# EAGLE design rs232 (EAGLE 5.11)
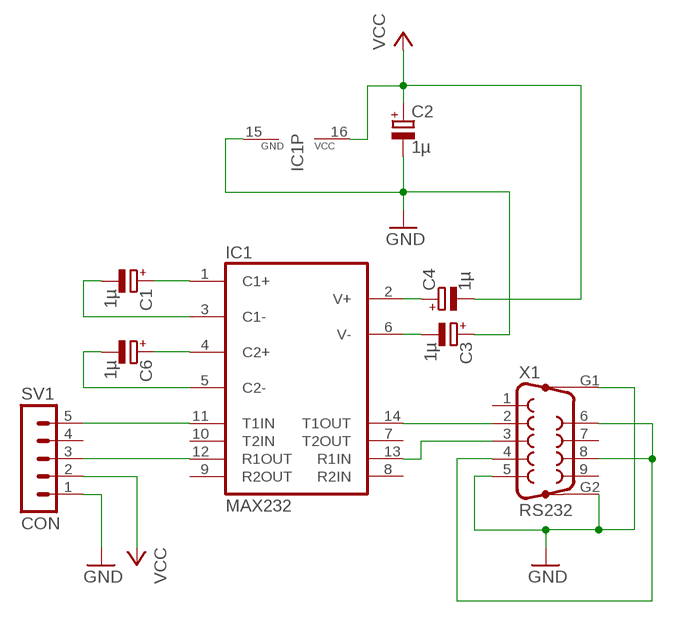
[diagram p0: schematic, sheet 1]

## Parts
C1  1µ  CPOL-EUE2.5-6  [E2,5-6]
C2  1µ  CPOL-EUE2.5-6  [E2,5-6]
C3  1µ  CPOL-EUE2.5-6  [E2,5-6]
C4  1µ  CPOL-EUE2.5-6  [E2,5-6]
C6  1µ  CPOL-EUE2.5-6  [E2,5-6]
IC1  MAX232  [DIL16]
SV1  CON  MA05-1  [MA05-1]
X1  RS232  F09HP  [F09HP]

## Nets
GND: C2.- C3.+ IC1.15(GND) SV1.1 X1.5 X1.G1 X1.G2
N$1: C1.+ IC1.1(C1+)
N$2: C1.- IC1.3(C1-)
N$3: C6.+ IC1.4(C2+)
N$4: C6.- IC1.5(C2-)
N$5: IC1.11(T1IN) SV1.5
N$6: IC1.12(R1OUT) SV1.3
N$7: C3.- IC1.6(V-)
N$8: C4.+ IC1.2(V+)
N$16: IC1.14(T1OUT) X1.2
N$17: IC1.13(R1IN) X1.3
N$18: X1.4 X1.6 X1.8
VCC: C2.+ C4.- IC1.16(VCC) SV1.2
Unconnected: IC1.7(T2OUT) IC1.8(R2IN) IC1.9(R2OUT) IC1.10(T2IN) SV1.4 X1.1 X1.7 X1.9

## Library data of the parts
C1-C4 C6 = rcl:CPOL-EU: POLARIZED CAPACITOR, European symbol
IC1 = maxim:MAX232: RS232 TRANSEIVER; MF: MAXIM; MPN: MAX232ACPE+; OC_FARNELL: 9723773; OC_NEWARK: 68K4544
SV1 = con-lstb:MA05-1: PIN HEADER; OC_FARNELL: unknown; OC_NEWARK: unknown
X1 = con-subd:F09HP: SUB-D; OC_FARNELL: unknown; OC_NEWARK: unknown

## Board
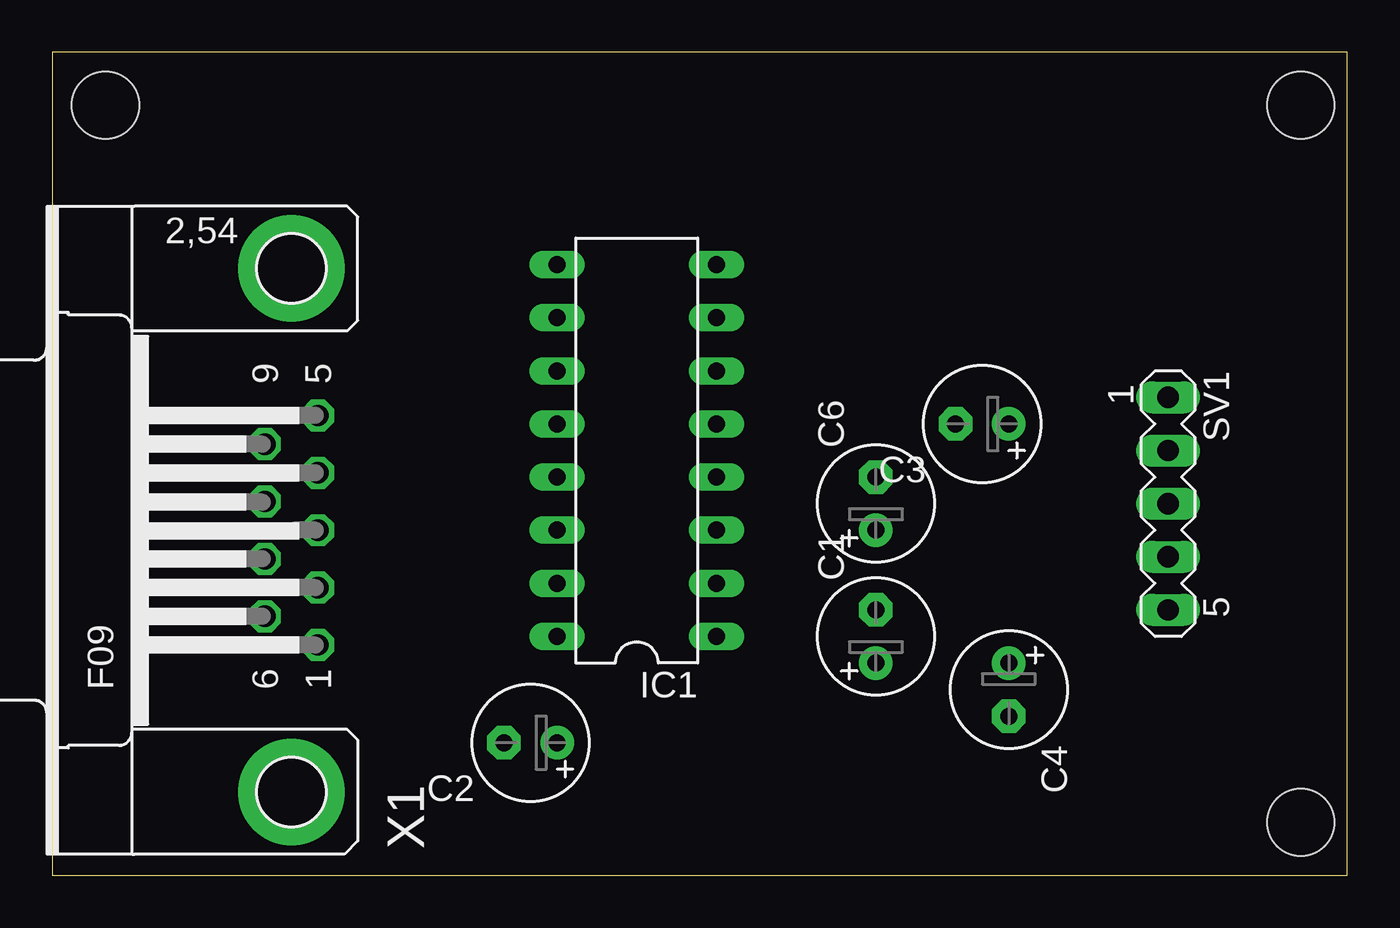
[diagram p1: board, top side]
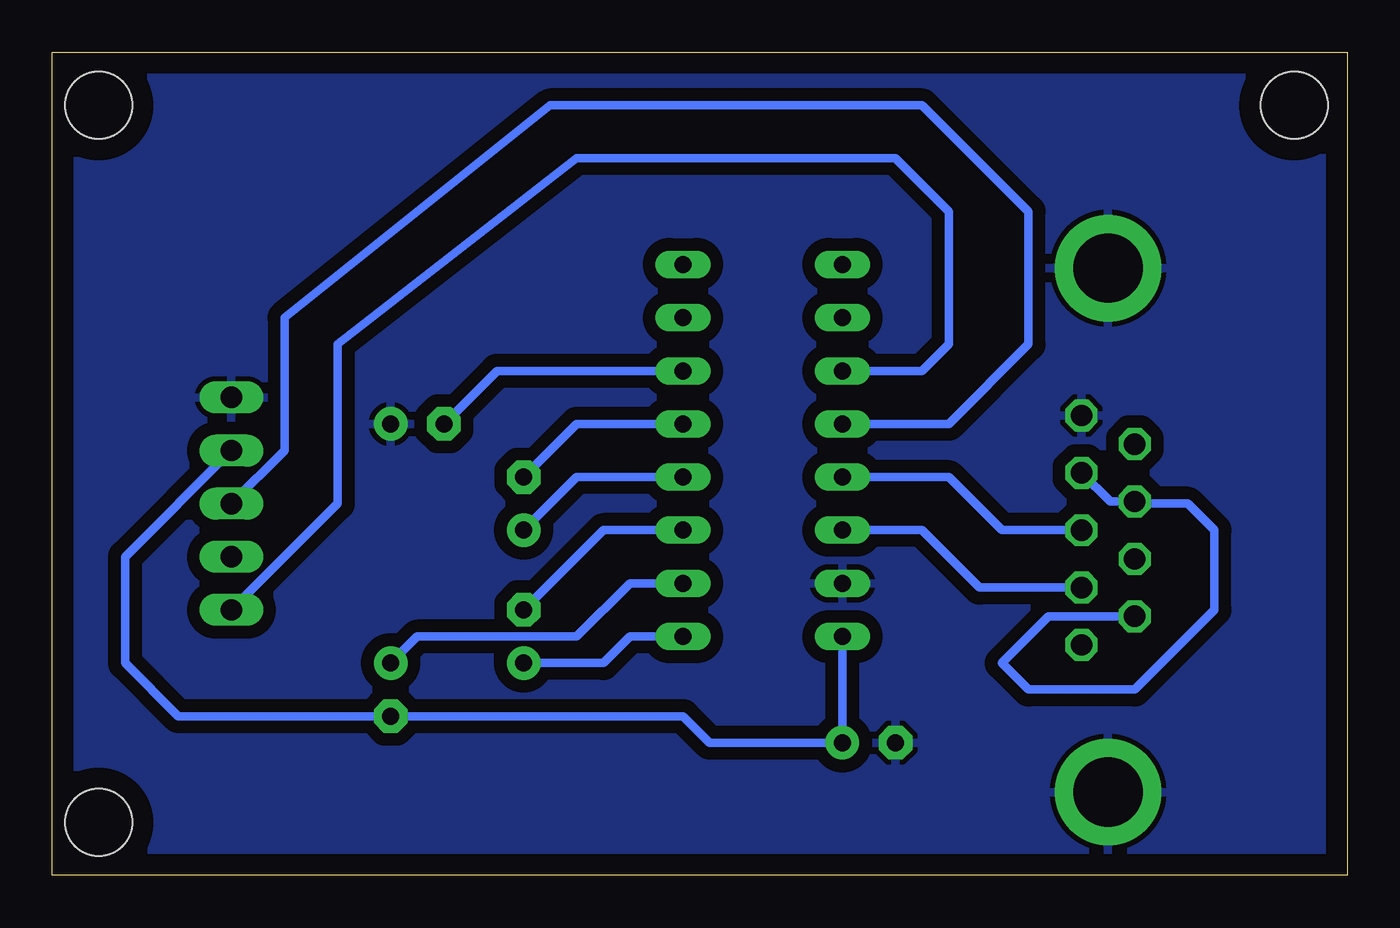
[diagram p2: board, bottom side, seen from below]

Size 61.9 x 39.36 mm. Coordinates in mm from the lower left corner, seen from the top.
Outline: 0,0 61.9,0 61.9,39.36 0,39.36 0,0
Copper layers (1*16): Top 0.035mm / dielectric 1.5mm / Bottom 0.035mm
Design rules "default": minimum track width 10mil, minimum drill 24mil, track to track 8mil, track to pad 8mil, pad to pad 8mil, via to via 8mil, smd to smd 8mil, copper to edge 40mil, drill to drill 8mil, minimum pad ring 10mil, minimum via ring 8mil, stop-mask expansion 4mil, vias tented up to drill 0mil, thermal gap 10mil
Holes 3.2 mm at 2.54,36.83 59.69,36.83 59.69,2.54

### Footprints (pad centres in the part's own frame; a part is rotated, then mirrored left to right if it is on the bottom)
E2,5-6 = drill 0.813 pad 1.6 round: + -1.27,0 | drill 0.813 pad 1.6 octagon: - 1.27,0
DIL16 = drill 0.813 long: 1 -8.89,-3.81; 2 -6.35,-3.81; 3 -3.81,-3.81; 4 -1.27,-3.81; 5 1.27,-3.81; 6 3.81,-3.81; 7 6.35,-3.81; 8 8.89,-3.81; 9 8.89,3.81; 10 6.35,3.81; 11 3.81,3.81; 12 1.27,3.81; 13 -1.27,3.81; 14 -3.81,3.81; 15 -6.35,3.81; 16 -8.89,3.81
MA05-1 = drill 1.016 long: 1 -5.08,0; 2 -2.54,0; 3 0,0; 4 2.54,0; 5 5.08,0
F09HP = drill 1.016 octagon: 1 -5.486,-1.27; 2 -2.743,-1.27; 3 0,-1.27; 4 2.743,-1.27; 5 5.486,-1.27; 6 -4.115,1.27; 7 -1.372,1.27; 8 1.372,1.27; 9 4.115,1.27 | drill 3.302 pad 5.08 round: G1 -12.522,0; G2 12.522,0

### Placement (x,y rotation side)
C1  39.37,11.43 90 top
C2  22.86,6.35 180 top
C3  44.45,21.59 180 top
C4  45.72,8.89 270 top
C6  39.37,17.78 90 top
IC1  27.94,20.32 90 top
SV1  53.34,17.78 270 top
X1  11.43,16.51 90 top

### Tracks (layer width: path | path; a pad name or v marks a point on that pad's centre or on a via)
GND
  pour Bottom (isolate 0.61): 0,39.37 0,0 62.23,0 62.23,39.37
N$1
  Bottom 0.406: IC1.1 34.29,11.43 35.56,10.16 C1.+
N$2
  Bottom 0.406: IC1.3 35.56,16.51 C1.-
N$3
  Bottom 0.406: IC1.4 36.83,19.05 C6.+
N$4
  Bottom 0.406: IC1.5 36.83,21.59 C6.-
N$5
  Bottom 0.406: IC1.11 20.32,24.13 19.05,25.4 19.05,31.75 21.59,34.29 36.83,34.29 48.26,25.4 48.26,17.78 SV1.5
N$6
  Bottom 0.406: IC1.12 19.05,21.59 15.24,25.4 15.24,31.75 20.32,36.83 38.1,36.83 50.8,26.67 50.8,20.32 SV1.3
N$7
  Bottom 0.406: IC1.6 40.64,24.13 C3.-
N$8
  Bottom 0.406: IC1.2 34.29,13.97 36.83,11.43 44.45,11.43 C4.+
N$16
  Bottom 0.406: X1.2 17.58,13.77 20.32,16.51 IC1.14
N$17
  Bottom 0.406: X1.3 16.51,16.51 19.05,19.05 IC1.13
N$18
  Bottom 0.406: X1.6 14.28,12.39 16.51,10.16 15.24,8.89 10.16,8.89 6.35,12.7 6.35,16.51 7.62,17.78 10.06,17.78 X1.8 11.33,17.88 X1.4
VCC
  Bottom 0.406: SV1.2 58.42,15.24 58.42,10.16 55.88,7.62 C4.- 31.75,7.62 30.48,6.35 C2.+ IC1.16